# Altium schematic sheet medminds_schdoc.SchDoc
size A; SheetNumber: 1; SheetTotal: 1
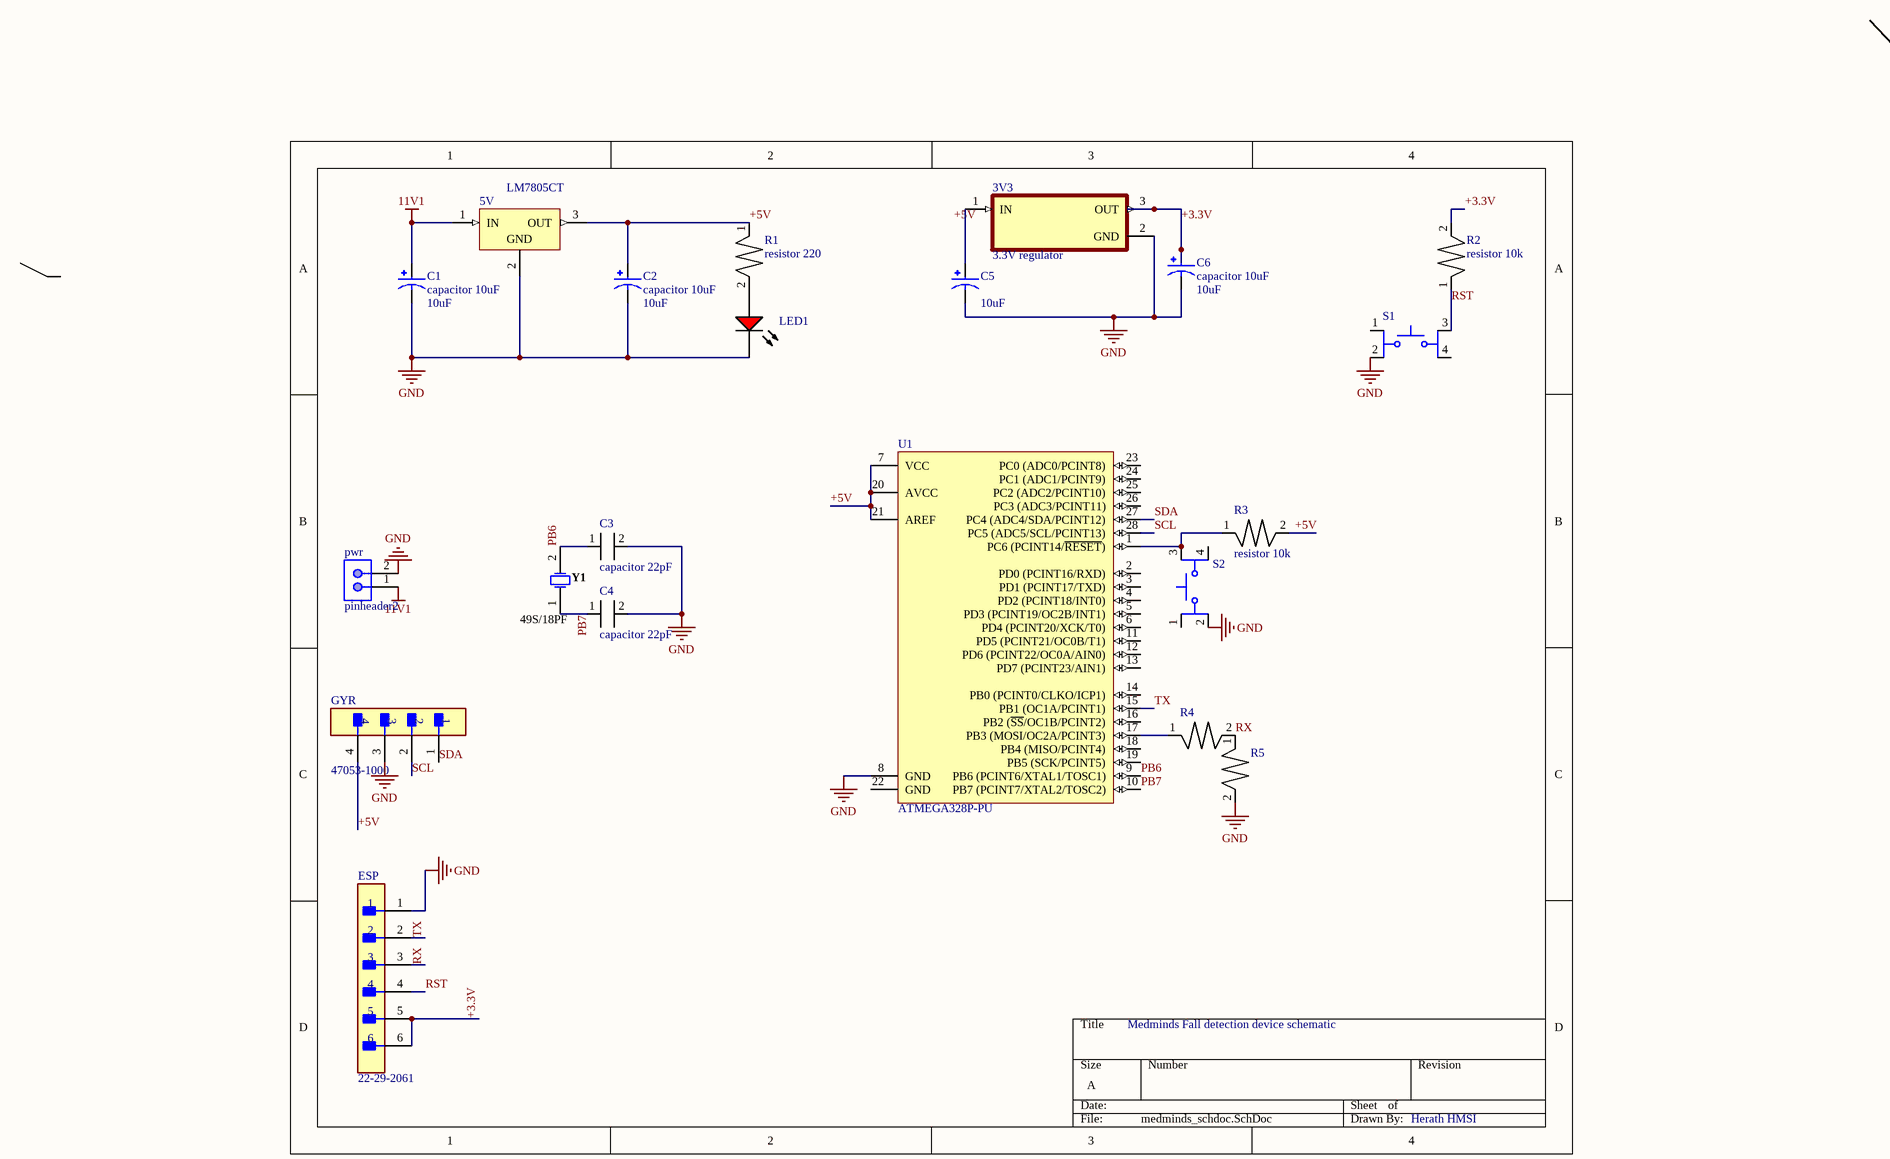
[diagram p0: medminds_schdoc.SchDoc]

## Parts
3V3  3.3V regulator  [3.3V regulator]
5V  LM7805CT  [FAIR-TO-220-3]
C1  capacitor 10uF  value 10uF  [Capacitor10uF]
C2  capacitor 10uF  value 10uF  [Capacitor10uF]
C3  capacitor 22pF  [Capacitor - duplicate]
C4  capacitor 22pF  [Capacitor - duplicate]
C5  value 10uF  [Capacitor10uF]  (hidden comment: capacitor 10uF)
C6  capacitor 10uF  value 10uF  [Capacitor10uF]
ESP  22-29-2061  [FP-22-29-2061-MFG]
GYR  47053-1000  [FP-47053-1000-MFG]
LED1  LED1  [INDPR60-254-520X380X650]  (value not drawn)
pwr  pinheader2  [TECO-5-146280-2_V]
R1  resistor 220  [Axial 0.4]
R2  resistor 10k  [Axial 0.4]
R3  resistor 10k  [Axial 0.4]
R4  resistor1k  [Axial 0.4]  (value not drawn)
R5  resistor 2k  [Axial 0.4]  (value not drawn)
S1  tacktile switch  [SW_TL1105AF160Q]  (value not drawn)
S2  tacktile switch  [SW_TL1105AF160Q]  (value not drawn)
U1  ATMEGA328P-PU  [ATML-28P3]
Y1  49S/18PF  [JPY-49S-18PF]

## Nets
11V1: 5V.1(IN) C1.P pwr.1
GND: 3V3.2(GND) 5V.2(GND) C1.N C2.N C3.2 C4.2 C5.N C6.N ESP.1 GYR.3 LED1.2(K) pwr.2 R5.2 S1.2 S2.2 U1.8(GND)
+3.3V: 3V3.3(OUT) C6.P ESP.5 ESP.6 R2.2
+5V: 3V3.1(IN) 5V.3(OUT) C2.P C5.P GYR.4 R1.1 R3.2 U1.7(VCC) U1.20(AVCC) U1.21(AREF)
PB6: C3.1 U1.9(PB6_(PCINT6/XTAL1/TOSC1)) Y1.2
PB7: C4.1 U1.10(PB7_(PCINT7/XTAL2/TOSC2)) Y1.1
RST: ESP.4 R2.1 S1.3
RX: ESP.3 R4.2 R5.1
SCL: GYR.2 U1.28(PC5_(ADC5/SCL/PCINT13))
SDA: GYR.1 U1.27(PC4_(ADC4/SDA/PCINT12))
TX: ESP.2 U1.15(PB1_(OC1A/PCINT1))
NetLED1_1: LED1.1(A) R1.2
NetR3_1: R3.1 S2.3 U1.1(PC6_(PCINT14/~{RESET}))
NetR4_1: R4.1 U1.17(PB3_(MOSI/OC2A/PCINT3))

Not connected (* = marked no-connect by the designer): S1 1 4; S2 1 4; U1 2(PD0_(PCINT16/RXD)) 3(PD1_(PCINT17/TXD)) 4(PD2_(PCINT18/INT0)) 5(PD3_(PCINT19/OC2B/INT1)) 6(PD4_(PCINT20/XCK/T0)) 11(PD5_(PCINT21/OC0B/T1)) 12(PD6_(PCINT22/OC0A/AIN0)) 13(PD7_(PCINT23/AIN1)) 14(PB0_(PCINT0/CLKO/ICP1)) 16(PB2_(~{SS}/OC1B/PCINT2)) 18(PB4_(MISO/PCINT4)) 19(PB5_(SCK/PCINT5)) 22(GND) 23(PC0_(ADC0/PCINT8)) 24(PC1_(ADC1/PCINT9)) 25(PC2_(ADC2/PCINT10)) 26(PC3_(ADC3/PCINT11))

## Notes on the sheet
- Medminds Fall detection device schematic
- Herath HMSI

## Library data of the parts
3V3 = 3.3V regulator: pin to pad: 2>3 3>2
5V = CMP-019-00050-1: Fixed Positive Standard Regulator, 5VBIPolar, PSFM3; Max Supply Voltage: 25V; Pins: 3; Case/Package: TO-220; RoHS Compliant: Yes
C1 C2 C5 C6 = ECA-1HM100I (2): Aluminum Electrolytic Capacitor, Polarized, Aluminum (wet), 50V, 20% +Tol, 20% -Tol, 10uF, Through Hole Mount; Manufacturer: Panasonic; Dielectric Material: Aluminium; Leakage Current: 5uA; Ripple Current: 65mA; Tan Delta: 0.12; Supplier: Mouser; Supplier Part Number: 667-ECA-1HM100I; Manufacturer Part Number: ECA-1HM100I; RoHS: Yes; Category: Aluminum Electrolytic Capacitors; Stock: 35307; Pricing: 1=0.28, 10=0.193, 50=0.116, 100=0.098, 400=0.06, 1000=0.06, 2000=0.056, 4000=0.051, 8000=0.048, 10000=0.048 (USD); Mounting Technology: Through Hole; Pins: 2; Package Shape: Cylindrical; Terminal Finish: Tin; Min Operating Temperature: -40°C; Max Operating Temperature: 85°C; JESD-609 Code: e3; Package Style: RadialMeter; Packaging: Tape and Reel; Termination: Wire; Polarity: Polarized; Capacitor Type: Aluminium; Tolerance  (fill in as +-): 20%; Tolerance (fill in as +-): 20%; Rated DC Voltage (URdc): 50V; Diameter: 5mm; Length: 11mm; Terminal Pitch: 2.5mm; Reach SVHC Compliant: Yes; RoHS Compliant: Yes; ComponentLink1URL: https://datasheet.ciiva.com:443/pdfs/VipMasterIC/IC/PANA/PANA-S-A0009891632/PANA-S-A0009891632-1.pdf?src-supplier=IHS+Markit; ComponentLink1Description: https://datasheet.ciiva.com:443/pdfs/VipMasterIC/IC/PANA/PANA-S-A0009891632/PANA-S-A0009891632-1.pdf?src-supplier=IHS+Markit; ComponentLink2URL: https://datasheet.ciiva.com/14608/70067785-14608821.pdf?src-supplier=Allied+Electronics; ComponentLink2Description: https://datasheet.ciiva.com/14608/70067785-14608821.pdf?src-supplier=Allied+Electronics; ComponentLink3URL: https://datasheet.ciiva.com/15197/getdatasheetpartid-238364-15197946.pdf?src-supplier=Verical; ComponentLink3Description: https://datasheet.ciiva.com/15197/getdatasheetpartid-238364-15197946.pdf?src-supplier=Verical; ComponentLink4URL: https://datasheet.ciiva.com/7794/1907780-7794379.pdf?src-supplier=Element14; ComponentLink4Description: https://datasheet.ciiva.com/7794/1907780-7794379.pdf?src-supplier=Element14; ComponentLink5URL: https://datasheet.ciiva.com/2984/aba0000ce12-2984335.pdf?src-supplier=Avnet; ComponentLink5Description: https://datasheet.ciiva.com/2984/aba0000ce12-2984335.pdf?src-supplier=Avnet; ComponentLink6URL: https://datasheet.ciiva.com/6121/aba0000ce12-6121535.pdf?src-supplier=Farnell; ComponentLink6Description: https://datasheet.ciiva.com/6121/aba0000ce12-6121535.pdf?src-supplier=Farnell; ComponentLink7URL: https://datasheet.ciiva.com/28677/aba0000ce12-28677830.pdf?src-supplier=Element14; ComponentLink7Description: https://datasheet.ciiva.com/28677/aba0000ce12-28677830.pdf?src-supplier=Element14; ComponentLink8URL: https://datasheet.ciiva.com/24234/aba0000ce12-465472-24234949.pdf?src-supplier=Mouser; ComponentLink8Description: https://datasheet.ciiva.com/24234/aba0000ce12-465472-24234949.pdf?src-supplier=Mouser
C3 C4 = DE21XSA220KN3AX02F: Ceramic Capacitor, Ceramic, 10% +Tol, 10% -Tol, SL, -1000/+350ppm/Cel TC, 0.000022uF, Through Hole Mount; Manufacturer: Murata; Supplier: Mouser; Supplier Part Number: 81-DE21XSA220KN3AX2F; Manufacturer Part Number: DE21XSA220KN3AX02F; RoHS: Yes; Category: Ceramic Capacitors; Stock: 156; Pricing: 1=0.38, 10=0.252, 50=0.252, 100=0.151, 1000=0.095, 10000=0.09 (USD)
GYR = CMP-04776-000290-1: CONN HEADER VERT 4POS 2.54MM; Number of Positions: 4; Voltage Rating (DC): 250V; Gender: Male; Current Rating: 4A; Glow Wire Compliant: Non-compliant; Contact Material: Brass; Contact Plating: Tin; Radiation Hardening: No; Package Quantity: 12000; Packaging: Bulk; Termination: Through Hole; Depth: 5.84mm; Series: 47053; Number of Contacts: 4; Length: 10.2mm; Halogen Free: Low Halogen; Number of Circuits: 4; Max Operating Temperature: 75°C; Housing Color: Beige; Min Operating Temperature: 0°C; Number of Rows: 1; Pitch: 2.54mm; Housing Material: Nylon; Orientation: Vertical; Mount: Through Hole; Voltage Rating: 250V
LED1 = CMP-007-00018-2: LED Uni-Color Red, 100 mW, 30 mA, -55 to 100 degC, 2-Pin THD, RoHS, Bulk; Manufacturer: Lite-On; Forward Current: 20mA; Nominal Vf: 2V; Viewing Angle: 60degrees; Luminous Intensity: 12.6mcd; Lens Style: Dome; Pins: 2; RoHS Compliant: True; Package Reference: LTL-1CHE; Package Quantity: 1000; Mounting Technology: TH; Min Operating Temperature: -55°C; Colour: Red; Case/Package: Radial; Manufacturer URL: http://www.us.liteon.com/; Datasheet URL: https://datasheet.ciiva.com/15117/getdatasheetpartid-187746-15117985.pdf; Forward Voltage: 2V; Max Operating Temperature: 100°C; Illumination Colour: Red; Package Description: 2-Pin Through Hole Device, Dia 3.8 mm, Pitch 2.54 mm; Packaging: Bulk; Datasheet Version: Dec-03
R1 = CF14JT220R: Fixed Resistor, Carbon Film, 0.25W, 220ohm, 350V, 5% +/-Tol, -400,0ppm/Cel, Through Hole Mount; Manufacturer: Stackpole Electronics; Power: 250mW; Rated Temperature: 70°C; Value: 220R; Temperature Coefficient: 400ppm/°C; Lead Diameter: 0.55mm; Lead Length: 28mm; Package Diameter: 2.3mm; Package Length: 6mm; Supplier: Digi-Key; Supplier Part Number: CF14JT220RCT-ND; Manufacturer Part Number: CF14JT220R; RoHS: Yes; Category: Through-Hole Resistors; Stock: 166405; Pricing: 1=0.1, 10=0.056, 25=0.0404, 50=0.0308, 100=0.0226, 250=0.01728, 500=0.01382, 1000=0.01017 (USD); Mounting Technology: Through Hole; Pins: 2; Package Shape: Tubular; Terminal Finish: Tin; Min Operating Temperature: -55°C; Max Operating Temperature: 155°C; Tolerance: 5%; Resistor Type: FIXED RESISTOR; Construction: Tubular; Package Style: AxialMeter; Packaging: Tape and Reel; Technology: CARBON FILM; Termination: Wire; Working Voltage: 350V; JESD-609 Code: e3; Reach SVHC Compliant: Yes; RoHS Compliant: Yes; ComponentLink1URL: https://datasheet.ciiva.com:443/pdfs/VipMasterIC/IC/SEIE/SEIE-S-A0009883960/SEIE-S-A0009883960-1.pdf?src-supplier=IHS+Markit; ComponentLink1Description: https://datasheet.ciiva.com:443/pdfs/VipMasterIC/IC/SEIE/SEIE-S-A0009883960/SEIE-S-A0009883960-1.pdf?src-supplier=IHS+Markit; ComponentLink2URL: https://www.seielect.com/catalog/SEI-CF_CFM.pdf?src-supplier=Avnet; ComponentLink2Description: https://www.seielect.com/catalog/SEI-CF_CFM.pdf?src-supplier=Avnet; ComponentLink3URL: http://components.arrow.com/part/dataview/44988614S316465N1174?src-supplier=Arrow+Electronics; ComponentLink3Description: http://components.arrow.com/part/dataview/44988614S316465N1174?src-supplier=Arrow+Electronics; ComponentLink4URL: https://www.verical.com/server-webapp/html/getDatasheet?partID=375100&src-supplier=Verical; ComponentLink4Description: https://www.verical.com/server-webapp/html/getDatasheet?partID=375100&src-supplier=Verical; ComponentLink5URL: https://www.seielect.com/catalog/SEI-Packaging.pdf?src-supplier=Digi-Key; ComponentLink5Description: https://www.seielect.com/catalog/SEI-Packaging.pdf?src-supplier=Digi-Key
R2 R3 = CF14JT10K0: Fixed Resistor, Carbon Film, 0.25W, 10000ohm, 350V, 5% +/-Tol, -500,0ppm/Cel, Through Hole Mount; Manufacturer: Stackpole Electronics; Power: 250mW; Rated Temperature: 70°C; Value: 10kR; Temperature Coefficient: 500ppm/°C; Lead Diameter: 0.55mm; Lead Length: 28mm; Package Diameter: 2.3mm; Package Length: 6mm; Supplier: Digi-Key; Supplier Part Number: CF14JT10K0TR-ND; Manufacturer Part Number: CF14JT10K0; RoHS: Yes; Category: Through-Hole Resistors; Pricing: 5000=0.00729, 10000=0.00633, 25000=0.00557, 50000=0.0051, 125000=0.005 (USD); Mounting Technology: Through Hole; Pins: 2; Package Shape: Tubular; Terminal Finish: Tin; Min Operating Temperature: -55°C; Max Operating Temperature: 155°C; Tolerance: 5%; Resistor Type: FIXED RESISTOR; Construction: Tubular; Package Style: AxialMeter; Packaging: Tape and Reel; Technology: CARBON FILM; Termination: Wire; Working Voltage: 350V; JESD-609 Code: e3; Reach SVHC Compliant: Yes; RoHS Compliant: Yes; ComponentLink1URL: https://datasheet.ciiva.com:443/pdfs/VipMasterIC/IC/SEIE/SEIE-S-A0009883960/SEIE-S-A0009883960-1.pdf?src-supplier=IHS+Markit; ComponentLink1Description: https://datasheet.ciiva.com:443/pdfs/VipMasterIC/IC/SEIE/SEIE-S-A0009883960/SEIE-S-A0009883960-1.pdf?src-supplier=IHS+Markit; ComponentLink2URL: http://components.arrow.com/part/dataview/27619991S9848636N1174?src-supplier=Arrow+Electronics; ComponentLink2Description: http://components.arrow.com/part/dataview/27619991S9848636N1174?src-supplier=Arrow+Electronics; ComponentLink3URL: https://www.seielect.com/catalog/SEI-CF_CFM.pdf?src-supplier=Avnet; ComponentLink3Description: https://www.seielect.com/catalog/SEI-CF_CFM.pdf?src-supplier=Avnet; ComponentLink4URL: https://www.seielect.com/catalog/SEI-Packaging.pdf?src-supplier=Digi-Key; ComponentLink4Description: https://www.seielect.com/catalog/SEI-Packaging.pdf?src-supplier=Digi-Key; ComponentLink5URL: https://www.verical.com/server-webapp/html/getDatasheet?partID=367360&src-supplier=Verical; ComponentLink5Description: https://www.verical.com/server-webapp/html/getDatasheet?partID=367360&src-supplier=Verical; ComponentLink6URL: http://www.seielect.com/Catalog/SEI-CF_CFM.pdf?src-supplier=Future+Electronics; ComponentLink6Description: http://www.seielect.com/Catalog/SEI-CF_CFM.pdf?src-supplier=Future+Electronics
R4 = CF14JT1K00: Fixed Resistor, Carbon Film, 0.25W, 1000ohm, 350V, 5% +/-Tol, -400,0ppm/Cel, Through Hole Mount; Manufacturer: Stackpole Electronics; Power: 250mW; Rated Temperature: 70°C; Value: 1kR; Temperature Coefficient: 400ppm/°C; Lead Diameter: 0.55mm; Lead Length: 28mm; Package Diameter: 2.3mm; Package Length: 6mm; Supplier: Digi-Key; Manufacturer Part Number: CF14JT1K00; RoHS: Yes; Category: Through-Hole Resistors; Stock: 2294681; Pricing: 1=0.1, 10=0.056, 25=0.0404, 50=0.0308, 100=0.0226, 250=0.01728, 500=0.01382, 1000=0.01017 (USD); Mounting Technology: Through Hole; Pins: 2; Package Shape: Tubular; Terminal Finish: Tin; Min Operating Temperature: -55°C; Max Operating Temperature: 155°C; Tolerance: 5%; Resistor Type: FIXED RESISTOR; Construction: Tubular; Package Style: AxialMeter; Packaging: Tape and Reel; Technology: CARBON FILM; Termination: Wire; Working Voltage: 350V; JESD-609 Code: e3; Reach SVHC Compliant: Yes; RoHS Compliant: Yes; ComponentLink1URL: https://datasheet.ciiva.com:443/pdfs/VipMasterIC/IC/SEIE/SEIE-S-A0009883960/SEIE-S-A0009883960-1.pdf?src-supplier=IHS+Markit; ComponentLink1Description: https://datasheet.ciiva.com:443/pdfs/VipMasterIC/IC/SEIE/SEIE-S-A0009883960/SEIE-S-A0009883960-1.pdf?src-supplier=IHS+Markit; ComponentLink2URL: http://components.arrow.com/part/dataview/27620077S9848643N1174?src-supplier=Arrow+Electronics; ComponentLink2Description: http://components.arrow.com/part/dataview/27620077S9848643N1174?src-supplier=Arrow+Electronics; ComponentLink3URL: http://www.seielect.com/Catalog/SEI-CF_CFM.pdf?src-supplier=Future+Electronics; ComponentLink3Description: http://www.seielect.com/Catalog/SEI-CF_CFM.pdf?src-supplier=Future+Electronics; ComponentLink4URL: https://www.seielect.com/catalog/SEI-CF_CFM.pdf?src-supplier=Avnet; ComponentLink4Description: https://www.seielect.com/catalog/SEI-CF_CFM.pdf?src-supplier=Avnet; ComponentLink5URL: https://www.seielect.com/catalog/SEI-Packaging.pdf?src-supplier=Digi-Key; ComponentLink5Description: https://www.seielect.com/catalog/SEI-Packaging.pdf?src-supplier=Digi-Key; ComponentLink6URL: https://www.seielect.com/Catalog/SEI-CF_CFM.pdf?src-supplier=Digi-Key; ComponentLink6Description: https://www.seielect.com/Catalog/SEI-CF_CFM.pdf?src-supplier=Digi-Key; ComponentLink7URL: https://www.verical.com/server-webapp/html/getDatasheet?partID=360403&src-supplier=Verical; ComponentLink7Description: https://www.verical.com/server-webapp/html/getDatasheet?partID=360403&src-supplier=Verical; Supplier Part Number: CF14JT1K00CT-ND
R5 = CF14JT2K00: Res Carbon Film 2K Ohm 5% 1/4W -400ppm/°C to 0ppm/°C Conformal AXL Thru-Hole T/R; Manufacturer: Stackpole Electronics; Value: 2kR; Max Power Dissipation: 250mW; Supplier: Arrow Electronics; Supplier Part Number: CF14JT2K00; Manufacturer Part Number: CF14JT2K00; RoHS: Yes; Category: Through-Hole Resistors; Stock: 1847; Pricing: 1=0.0513, 10=0.0369, 25=0.0295, 100=0.0188, 250=0.015, 500=0.0122, 1000=0.0084 (USD); Mounting Technology: Through Hole,Axial; Case/Package: Conformal; Contact Plating: Tin,Matte; Min Operating Temperature: -55°C; Max Operating Temperature: 155°C; Packaging: Tape and Reel; Tolerance: 5%; Temperature Coefficient: -400ppm/°C; Number of Terminations: 2; Features: Flame Retardant Coating; Series: CF; Power Rating: 250mW; Termination: Axial; Construction: Cylindrical; Diameter: 2.3mm; Length: 6.5mm; Radiation Hardening: No; RoHS Compliant: Yes; Military Standard: Not; Lead Free: Lead Free; ComponentLink1URL: https://www.verical.com/server-webapp/html/getDatasheet?partID=473981&src-supplier=Verical; ComponentLink1Description: https://www.verical.com/server-webapp/html/getDatasheet?partID=473981&src-supplier=Verical; ComponentLink2URL: https://www.seielect.com/Catalog/SEI-CF_CFM.pdf?src-supplier=Digi-Key; ComponentLink2Description: https://www.seielect.com/Catalog/SEI-CF_CFM.pdf?src-supplier=Digi-Key; ComponentLink3URL: https://www.seielect.com/catalog/SEI-Packaging.pdf?src-supplier=Digi-Key; ComponentLink3Description: https://www.seielect.com/catalog/SEI-Packaging.pdf?src-supplier=Digi-Key; ComponentLink4URL: http://www.seielect.com/Catalog/SEI-CF_CFM.pdf?src-supplier=Future+Electronics; ComponentLink4Description: http://www.seielect.com/Catalog/SEI-CF_CFM.pdf?src-supplier=Future+Electronics; ComponentLink5URL: https://www.seielect.com/catalog/SEI-CF_CFM.pdf?src-supplier=Avnet; ComponentLink5Description: https://www.seielect.com/catalog/SEI-CF_CFM.pdf?src-supplier=Avnet; ComponentLink6URL: http://components.arrow.com/part/dataview/27620168S9848612N1174?src-supplier=Arrow+Electronics; ComponentLink6Description: http://components.arrow.com/part/dataview/27620168S9848612N1174?src-supplier=Arrow+Electronics
S1 S2 = TL1105AF160Q: Keypad Switch, 1 Switches, SPST, Momentary-tactile, 0.05A, 12VDC, 2.06N, 4 PCB Hole Cnt, Solder Terminal, Through Hole-straight; Manufacturer: E-Switch; Manufacturer Series: TL1105; Circuit Configuration: 1X1; Contact Current(DC)-Max: 50mA; Contact DC Max Rating R Load: .05A@12VDC; Contact Voltage(DC)-Max: 12V; Electrical Life: 100000Cycles; Number of Switches: 1; Body Breadth: 6inch; Body Height: 3.6mm; Body Length or Diameter: 6mm; Supplier: Future Electronics; Supplier Part Number: 4125654; Manufacturer Part Number: TL1105AF160Q; RoHS: Yes; Category: Tactile Switches; Stock: 5048; Pricing: 1=0.185, 250=0.18, 1000=0.173, 2500=0.168, 10000=0.157 (USD); Mounting Technology: Through Hole; Terminal Finish: Silver; Min Operating Temperature: -20°C; Max Operating Temperature: 70°C; JESD-609 Code: e4; Operating Force-Max: 2.06N; Switch Action: MOMENTARY-TACTILE; Switch Function: SPST; Switch Type: Keypad; Termination: Solder; Reach SVHC Compliant: Yes; RoHS Compliant: Yes; ComponentLink1URL: https://datasheet.ciiva.com:443/pdfs/VipMasterIC/IC/ESCH/ESCH-S-A0000509546/ESCH-S-A0000506372-1.pdf?src-supplier=IHS+Markit; ComponentLink1Description: https://datasheet.ciiva.com:443/pdfs/VipMasterIC/IC/ESCH/ESCH-S-A0000509546/ESCH-S-A0000506372-1.pdf?src-supplier=IHS+Markit; ComponentLink2URL: https://datasheet.ciiva.com/16156/p010002-16156245.pdf?src-supplier=Onlinecomponents.com; ComponentLink2Description: https://datasheet.ciiva.com/16156/p010002-16156245.pdf?src-supplier=Onlinecomponents.com; ComponentLink3URL: https://datasheet.ciiva.com/1701/tl1105-1701408.pdf?src-supplier=Newark; ComponentLink3Description: https://datasheet.ciiva.com/1701/tl1105-1701408.pdf?src-supplier=Newark; ComponentLink4URL: https://datasheet.ciiva.com/2900/tl1105-2900854.pdf?src-supplier=Digi-Key; ComponentLink4Description: https://datasheet.ciiva.com/2900/tl1105-2900854.pdf?src-supplier=Digi-Key
U1 = CMP-020-00004-3: 8-Bit Microcontroller with 32 KBytes In-System Programmable Flash, 23 I/Os, -40 to 85 degC, 28-Pin PDIP (28P3), RoHS, Tube; Manufacturer: Atmel; I/Os: 23; Density: 32KB; Package Version: Rev. B, 09/2001; Max Clock Frequency: 20MHz; Interface: USART; Max Supply Voltage: 5.5V; Min Supply Voltage: 1.8V; Ethernet Channels: 0; RAM Size: 2KB; RoHS Compliant: True; Datasheet URL: http://www.atmel.com/images/Atmel-8271-8-bit-AVR-Microcontroller-ATmega48A-48PA-88A-88PA-168A-168PA-328-328P_datasheet_Complete.pdf; Packaging: Rail/Tube; Manufacturer URL: http://www.atmel.com/; Mounting Technology: TH; Package URL: http://www.atmel.com/images/Atmel-8271-8-bit-AVR-Microcontroller-ATmega48A-48PA-88A-88PA-168A-168PA-328-328P_datasheet_Complete.pdf; Datasheet Version: Rev. 8271J, 11/2015; Package Description: 28-Pin Plastic Dual Inline Package, Body 34.671 x 7.3025 mm, Pitch 2.54 mm; Package Quantity: 14; Min Operating Temperature: -40°C; Max Operating Temperature: 85°C; Case/Package: DIP; Pins: 28; Package Reference: 28P3
Y1 = CMP-003-00000-2: Crystal, 16 MHz, +/-20 ppm, 18 pF, -20 to 70 degC, 2-Pin THD, RoHS; Manufacturer: Shenzhen Jingpengyuan; Frequency: 16MHz; Package Description: 2-Pin Through Hole Device, Body 11.05 x 4.65 mm, Pitch 4.88 mm; Mounting Technology: TH; Datasheet Version: Aug-14; Package Reference: 49S-18PF; RoHS Compliant: Unknown; Datasheet URL: http://datasheet.octopart.com/49S-18PF-Xinhunjing-datasheet-30677139.pdf; Case/Package: 49S-18PF; Manufacturer URL: http://www.chjiahui.com/